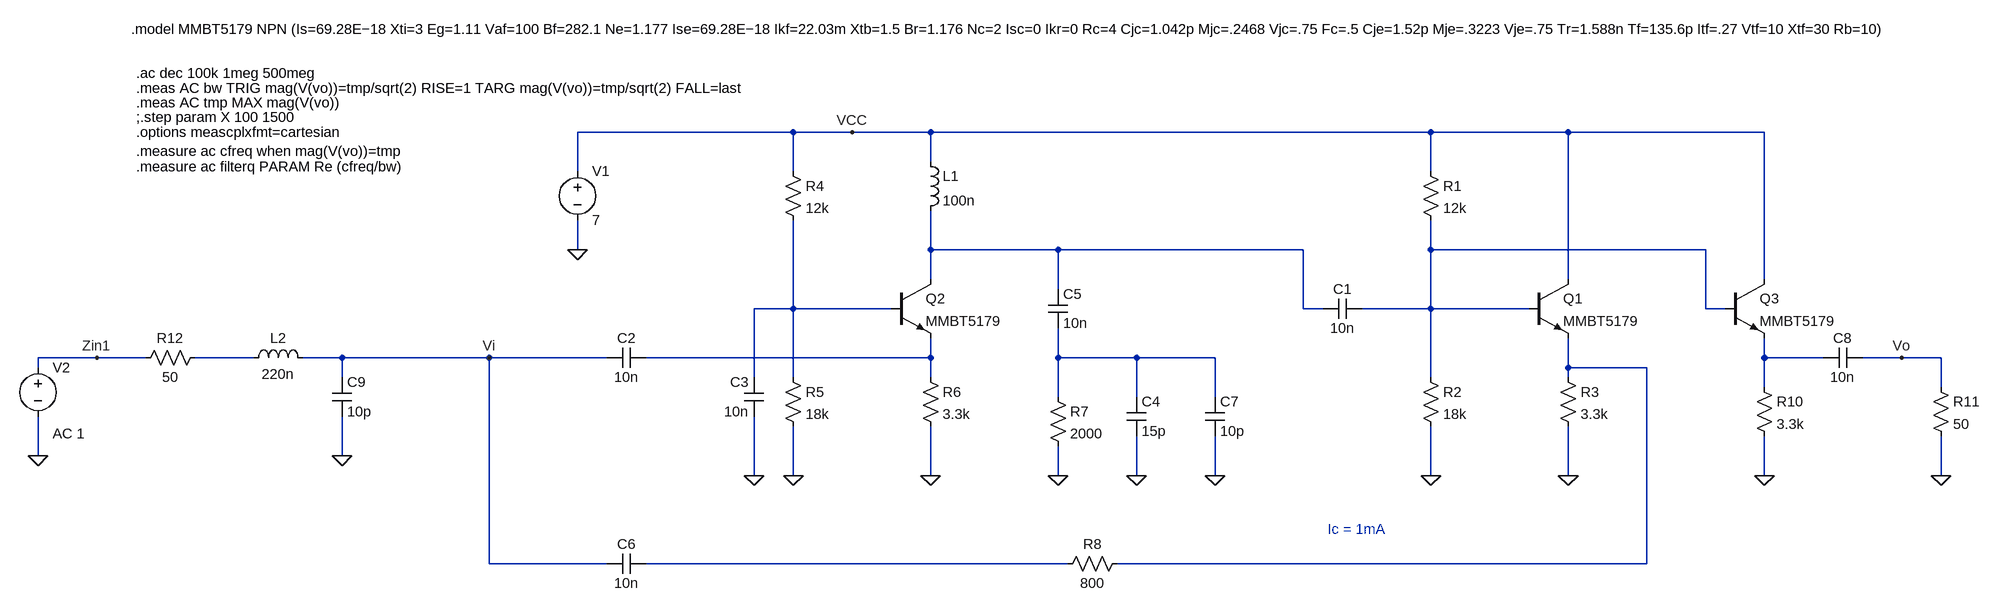
[diagram p0: schematic CC-amplifier.asc]
CC-amplifier.asc, the LTspice schematic file:
Version 4
SHEET 1 2772 904
WIRE -448 -144 -800 -144
WIRE -352 -144 -448 -144
WIRE -224 -144 -352 -144
WIRE 592 -144 -224 -144
WIRE 816 -144 592 -144
WIRE 1136 -144 816 -144
WIRE -224 -96 -224 -144
WIRE -800 -80 -800 -144
WIRE -448 -80 -448 -144
WIRE 592 -80 592 -144
WIRE -800 48 -800 0
WIRE -224 48 -224 -16
WIRE -16 48 -224 48
WIRE 384 48 -16 48
WIRE 592 48 592 0
WIRE 1040 48 592 48
WIRE -224 96 -224 48
WIRE 816 96 816 -144
WIRE 1136 96 1136 -144
WIRE -16 112 -16 48
WIRE -448 144 -448 0
WIRE -448 144 -512 144
WIRE -288 144 -448 144
WIRE 384 144 384 48
WIRE 416 144 384 144
WIRE 592 144 592 48
WIRE 592 144 480 144
WIRE 752 144 592 144
WIRE 1040 144 1040 48
WIRE 1072 144 1040 144
WIRE -1584 224 -1680 224
WIRE -1504 224 -1584 224
WIRE -1328 224 -1424 224
WIRE -1184 224 -1248 224
WIRE -944 224 -1184 224
WIRE -752 224 -944 224
WIRE -224 224 -224 192
WIRE -224 224 -688 224
WIRE -16 224 -16 176
WIRE 112 224 -16 224
WIRE 240 224 112 224
WIRE 1136 224 1136 192
WIRE 1232 224 1136 224
WIRE 1360 224 1296 224
WIRE 1424 224 1360 224
WIRE -1680 240 -1680 224
WIRE 816 240 816 192
WIRE 944 240 816 240
WIRE -1184 256 -1184 224
WIRE -512 256 -512 144
WIRE -448 256 -448 144
WIRE -224 256 -224 224
WIRE 592 256 592 144
WIRE 816 256 816 240
WIRE 1136 272 1136 224
WIRE 1424 272 1424 224
WIRE -16 288 -16 224
WIRE 112 288 112 224
WIRE 240 288 240 224
WIRE -1680 384 -1680 320
WIRE -1184 384 -1184 320
WIRE -512 416 -512 320
WIRE -448 416 -448 336
WIRE -224 416 -224 336
WIRE -16 416 -16 368
WIRE 112 416 112 352
WIRE 240 416 240 352
WIRE 592 416 592 336
WIRE 816 416 816 336
WIRE 1136 416 1136 352
WIRE 1424 416 1424 352
WIRE -944 560 -944 224
WIRE -752 560 -944 560
WIRE 0 560 -688 560
WIRE 944 560 944 240
WIRE 944 560 80 560
FLAG -800 48 0
FLAG 592 416 0
FLAG 816 416 0
FLAG -1680 384 0
FLAG -1584 224 Zin1
FLAG -448 416 0
FLAG -224 416 0
FLAG -352 -144 VCC
FLAG -512 416 0
FLAG -16 416 0
FLAG 112 416 0
FLAG 1360 224 Vo
FLAG 240 416 0
FLAG 1136 416 0
FLAG 1424 416 0
FLAG -944 224 Vi
FLAG -1184 384 0
SYMBOL res 576 -96 R0
SYMATTR InstName R1
SYMATTR Value 12k
SYMBOL res 576 240 R0
SYMATTR InstName R2
SYMATTR Value 18k
SYMBOL res 800 240 R0
SYMATTR InstName R3
SYMATTR Value 3.3k
SYMBOL voltage -800 -96 R0
WINDOW 123 0 0 Left 0
WINDOW 39 0 0 Left 0
SYMATTR InstName V1
SYMATTR Value 7
SYMBOL npn 752 96 R0
SYMATTR InstName Q1
SYMATTR Value MMBT5179
SYMBOL cap 480 128 R90
WINDOW 0 0 32 VBottom 2
WINDOW 3 32 32 VTop 2
SYMATTR InstName C1
SYMATTR Value 10n
SYMBOL res -464 -96 R0
SYMATTR InstName R4
SYMATTR Value 12k
SYMBOL res -464 240 R0
SYMATTR InstName R5
SYMATTR Value 18k
SYMBOL res -240 240 R0
SYMATTR InstName R6
SYMATTR Value 3.3k
SYMBOL npn -288 96 R0
SYMATTR InstName Q2
SYMATTR Value MMBT5179
SYMBOL cap -688 208 R90
WINDOW 0 0 32 VBottom 2
WINDOW 3 32 32 VTop 2
SYMATTR InstName C2
SYMATTR Value 10n
SYMBOL res -32 272 R0
SYMATTR InstName R7
SYMATTR Value 2000
SYMBOL voltage -1680 224 R0
WINDOW 123 24 124 Left 2
WINDOW 39 24 152 Left 2
SYMATTR Value2 AC 1
SYMATTR InstName V2
SYMATTR Value ""
SYMBOL cap -496 320 R180
WINDOW 0 24 56 Left 2
WINDOW 3 24 8 Left 2
SYMATTR InstName C3
SYMATTR Value 10n
SYMBOL ind -240 -112 R0
SYMATTR InstName L1
SYMATTR Value 100n
SYMBOL cap 96 288 R0
SYMATTR InstName C4
SYMATTR Value 15p
SYMBOL cap -32 112 R0
SYMATTR InstName C5
SYMATTR Value 10n
SYMBOL cap -688 544 R90
WINDOW 0 0 32 VBottom 2
WINDOW 3 32 32 VTop 2
SYMATTR InstName C6
SYMATTR Value 10n
SYMBOL res 96 544 R90
WINDOW 0 0 56 VBottom 2
WINDOW 3 32 56 VTop 2
SYMATTR InstName R8
SYMATTR Value 800
SYMBOL npn 1072 96 R0
SYMATTR InstName Q3
SYMATTR Value MMBT5179
SYMBOL res 1120 256 R0
SYMATTR InstName R10
SYMATTR Value 3.3k
SYMBOL cap 1296 208 R90
WINDOW 0 0 32 VBottom 2
WINDOW 3 32 32 VTop 2
SYMATTR InstName C8
SYMATTR Value 10n
SYMBOL res 1408 256 R0
SYMATTR InstName R11
SYMATTR Value 50
SYMBOL cap 224 288 R0
SYMATTR InstName C7
SYMATTR Value 10p
SYMBOL res -1408 208 R90
WINDOW 0 0 56 VBottom 2
WINDOW 3 32 56 VTop 2
SYMATTR InstName R12
SYMATTR Value 50
SYMBOL ind -1344 240 R270
WINDOW 0 32 56 VTop 2
WINDOW 3 5 56 VBottom 2
SYMATTR InstName L2
SYMATTR Value 220n
SYMBOL cap -1200 256 R0
SYMATTR InstName C9
SYMATTR Value 10p
TEXT -1520 -240 Left 2 !.ac dec 100k 1meg 500meg
TEXT 424 504 Left 2 ;Ic = 1mA
TEXT -1528 -312 Left 2 !.model MMBT5179 NPN (Is=69.28E−18 Xti=3 Eg=1.11 Vaf=100 Bf=282.1 Ne=1.177 Ise=69.28E−18 Ikf=22.03m Xtb=1.5 Br=1.176 Nc=2 Isc=0 Ikr=0 Rc=4 Cjc=1.042p Mjc=.2468 Vjc=.75 Fc=.5 Cje=1.52p Mje=.3223 Vje=.75 Tr=1.588n Tf=135.6p Itf=.27 Vtf=10 Xtf=30 Rb=10)
TEXT -1520 -168 Left 2 !;.step param X 100 1500
TEXT -1520 -192 Left 2 !.meas AC tmp MAX mag(V(vo))
TEXT -1520 -216 Left 2 !.meas AC bw TRIG mag(V(vo))=tmp/sqrt(2) RISE=1 TARG mag(V(vo))=tmp/sqrt(2) FALL=last
TEXT -1520 -144 Left 2 !.options meascplxfmt=cartesian\n.measure ac cfreq when mag(V(vo))=tmp
TEXT -1520 -88 Left 2 !.measure ac filterq PARAM Re (cfreq/bw)

The netlist it stands for:
* CC-amplifier.asc
R1 VCC N002 12k
R2 N002 0 18k
R3 N008 0 3.3k
V1 VCC 0 7
Q1 VCC N002 N008 0 MMBT5179
C1 N002 N001 10n
R4 VCC N003 12k
R5 N003 0 18k
R6 N005 0 3.3k
Q2 N001 N003 N005 0 MMBT5179
C2 N005 Vi 10n
R7 N006 0 2000
V2 Zin1 0 AC 1
C3 0 N003 10n
L1 VCC N001 100n
C4 N006 0 15p
C5 N001 N006 10n
C6 N009 Vi 10n
R8 N008 N009 800
Q3 VCC N002 N007 0 MMBT5179
R10 N007 0 3.3k
C8 Vo N007 10n
R11 Vo 0 50
C7 N006 0 10p
R12 N004 Zin1 50
L2 N004 Vi 220n
C9 Vi 0 10p
.model NPN NPN
.model PNP PNP
.lib standard.bjt
.ac dec 100k 1meg 500meg
* Ic = 1mA
.model MMBT5179 NPN (Is=69.28E−18 Xti=3 Eg=1.11 Vaf=100 Bf=282.1 Ne=1.177 Ise=69.28E−18 Ikf=22.03m Xtb=1.5 Br=1.176 Nc=2 Isc=0 Ikr=0 Rc=4 Cjc=1.042p Mjc=.2468 Vjc=.75 Fc=.5 Cje=1.52p Mje=.3223 Vje=.75 Tr=1.588n Tf=135.6p Itf=.27 Vtf=10 Xtf=30 Rb=10)
;.step param X 100 1500
.meas AC tmp MAX mag(V(vo))
.meas AC bw TRIG mag(V(vo))=tmp/sqrt(2) RISE=1 TARG mag(V(vo))=tmp/sqrt(2) FALL=last
.options meascplxfmt=cartesian
.measure ac cfreq when mag(V(vo))=tmp
.measure ac filterq PARAM Re (cfreq/bw)
.backanno
.end